# EAGLE design STl-Link-V303 (EAGLE 7.6.0)
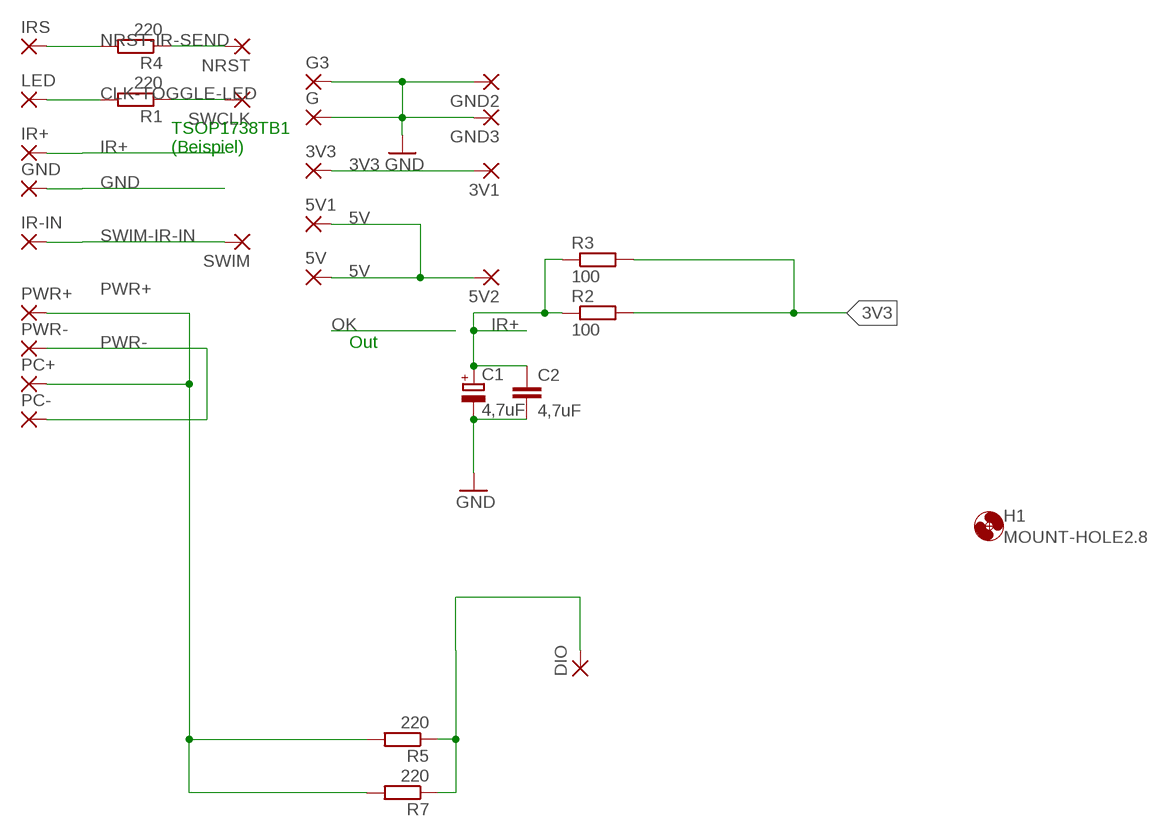
[diagram p0: schematic, sheet 1]

## Parts
3V1  SMD2  [SMD1,27-2,54]
3V3  SMD2  [SMD1,27-2,54]
5V  SMD2  [SMD1,27-2,54]
5V1  SMD2  [SMD1,27-2,54]
5V2  SMD2  [SMD1,27-2,54]
C1  4,7uF  CPOL-EUE1.8-4  [E1,8-4]
C2  4,7uF  C-EUC1206K  [C1206K]
DIO  SMD2  [SMD1,27-2,54]
G  SMD2  [SMD1,27-2,54]
G3  SMD2  [SMD1,27-2,54]
GND  SMD2  [SMD1,27-2,54]
GND2  SMD2  [SMD1,27-2,54]
GND3  SMD2  [SMD1,27-2,54]
H1  MOUNT-HOLE2.8  [2,8]
IR+  SMD2  [SMD1,27-2,54]
IR-IN  SMD2  [SMD1,27-2,54]
IRS  SMD2  [SMD1,27-2,54]
LED  SMD2  [SMD1,27-2,54]
NRST  SMD2  [SMD1,27-2,54]
PC+  SMD2  [SMD1,27-2,54]
PC-  SMD2  [SMD1,27-2,54]
PWR+  SMD2  [SMD1,27-2,54]
PWR-  SMD2  [SMD1,27-2,54]
R1  220  R-EU_R0805W  [R0805W]
R2  100  R-EU_0204/7  [0204/7]
R3  100  R-EU_R0805W  [R0805W]
R4  220  R-EU_R0805W  [R0805W]
R5  220  R-EU_0204/7  [0204/7]
R7  220  R-EU_R0805W  [R0805W]
SWCLK  SMD2  [SMD1,27-2,54]
SWIM  SMD2  [SMD1,27-2,54]

## Nets
3V3: 3V1.1(P) 3V3.1(P) R2.2 R3.2
5V [Power]: 5V1.1(P) 5V2.1(P) 5V.1(P)
CLK-TOGGLE-LED: R1.1 SWCLK.1(P)
DIO-EINSCH: DIO.1(P) R5.1 R7.1
GND [Power]: C1.- C2.2 G3.1(P) G.1(P) GND2.1(P) GND3.1(P) GND.1(P)
IR+: C1.+ C2.1 IR+.1(P) R2.1 R3.1
N$1: NRST.1(P) R4.1
N$2: LED.1(P) R1.2
NRST-IR-SEND: IRS.1(P) R4.2
PWR+: PC+.1(P) PWR+.1(P) R5.2 R7.2
PWR-: PC-.1(P) PWR-.1(P)
SWIM-IR-IN: IR-IN.1(P) SWIM.1(P)

## Notes on the sheet
- TSOP1738TB1
  (Beispiel)
- Out

## Library data of the parts
3V1 3V3 5V 5V1 5V2 DIO G G3 GND GND2 GND3 IR+ IR-IN IRS LED NRST PC+ PC- PWR+ PWR- SWCLK SWIM = wirepad:SMD2: SMD PAD
C1 = rcl:CPOL-EU: POLARIZED CAPACITOR, European symbol
C2 = rcl:C-EU: CAPACITOR, European symbol
H1 = holes:MOUNT-HOLE: MOUNTING HOLE with drill center marker
R1-R5 R7 = rcl:R-EU_: RESISTOR, European symbol

## Net classes
0 default: width 0.406 mm
1 Power: width 0.61 mm

## Board
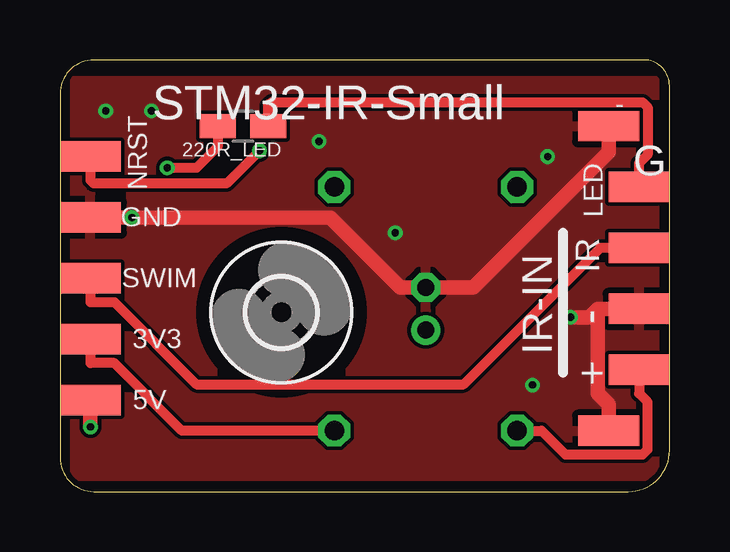
[diagram p1: board, top side]
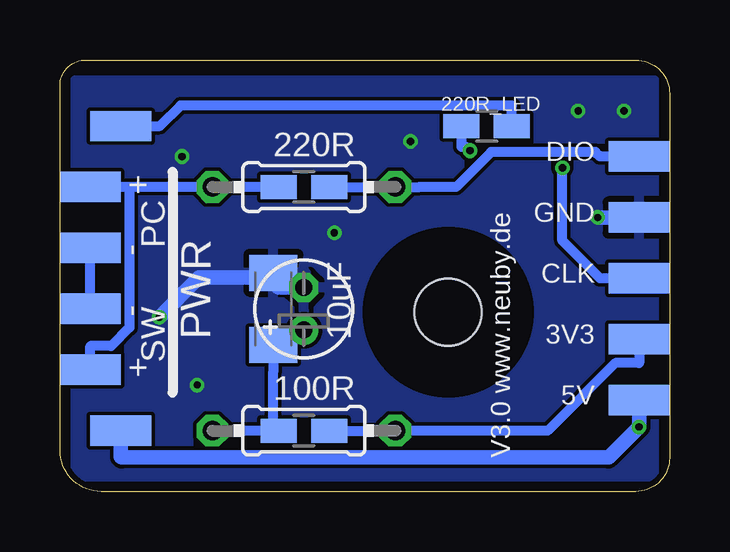
[diagram p2: board, bottom side, seen from below]

Size 25.4 x 18 mm. Coordinates in mm from the lower left corner, seen from the top.
Outline: 0,16.59 0,1.41 arc90 1.41,0 23.68,0 arc90 25.4,1.72 25.4,16.92 arc90 24.32,18 1.41,18 arc90 0,16.59
Copper layers (1*16): Top 0.035mm / dielectric 1.5mm / Bottom 0.035mm
Design rules "Fusion_eagle_rule_v1.1": minimum track width 6mil, minimum drill 12mil, track to track 6mil, track to pad 6mil, pad to pad 6mil, via to via 6mil, smd to smd 0mil, copper to edge 10mil, drill to drill 10mil, minimum pad ring 10mil, minimum via ring 6mil, stop-mask expansion 2mil, vias tented up to drill 100mil, thermal gap 10mil

### Footprints (pad centres in the part's own frame; a part is rotated, then mirrored left to right if it is on the bottom)
SMD1,27-2,54 = smd 1.27 x 2.54: 1 0,0
E1,8-4 = drill 0.711 pad 1.168: + -0.889,0 | drill 0.711 pad 1.168 octagon: - 0.889,0
C1206K = smd 1.5 x 2: 1 -1.5,0; 2 1.5,0
2,8 = hole 2.8: 0,0
R0805W = smd 1.5 x 1: 1 -1.052,0; 2 1.052,0
0204/7 = drill 0.813 octagon: 1 -3.81,0; 2 3.81,0

### Placement (x,y rotation side)
3V1  1.27,6.35 90 top
3V3  1.27,6.35 90 bottom
5V  22.86,2.54 270 bottom
5V1  1.27,3.81 90 bottom
5V2  1.27,3.81 90 top
C1  15.24,7.62 90 bottom
C2  16.51,7.62 90 bottom
DIO  1.27,13.97 90 bottom
G  22.86,15.24 90 top
G3  22.86,2.54 90 top
GND  24.13,7.62 90 top
GND2  1.27,11.43 90 top
GND3  1.27,11.43 90 bottom
H1  9.22,7.47 0 top
IR+  24.13,5.08 90 top
IR-IN  24.13,10.16 90 top
IRS  22.86,15.24 270 bottom
LED  24.13,12.7 270 top
NRST  1.27,13.97 90 top
PC+  24.13,12.7 90 bottom
PC-  24.13,10.16 90 bottom
PWR+  24.13,5.08 90 bottom
PWR-  24.13,7.62 90 bottom
R1  7.62,15.24 0 top
R2  15.24,2.54 0 bottom
R3  15.24,2.54 0 bottom
R4  7.62,15.24 0 bottom
R5  15.24,12.7 180 bottom
R7  15.24,12.7 180 bottom
SWCLK  1.27,8.89 90 bottom
SWIM  1.27,8.89 90 top

### Tracks (layer width: path | path; a pad name or v marks a point on that pad's centre or on a via)
3V3
  Top 0.406: 3V1.1 1.27,5.36 2.26,5.36 5.08,2.54 R2.2
  Bottom 0.406: 3V1.1 1.27,5.36 2.26,5.36 5.08,2.54 R2.2 R3.2
5V  (via drill 0.3 pad 0.61)
  Top 0.61: 5V2.1 v1.27,2.69
  Bottom 0.61: 5V.1 22.86,1.45 22.83,1.42 2.54,1.42 v1.27,2.69 5V2.1
CLK-TOGGLE-LED  (via drill 0.3 pad 0.61)
  Top 0.406: R1.1 6.57,14.38 5.69,13.51 v4.47,13.51
  Bottom 0.406: SWCLK.1 2.9,8.89 4.47,10.46 v4.47,13.51
DIO-EINSCH
  Bottom 0.406: R7.1 R5.1 10.41,12.7 8.9,12.7 7.43,14.17 3.09,14.17 2.9,13.97 DIO.1
GND  (via drill 0.3 pad 0.61)
  Top 0.61: v21.27,7.26 22.05,7.26 22.4,7.62 | 22.4,7.62 22.4,4.09 22.86,3.63 G3.1 | GND.1 22.4,7.62 | G.1 22.86,14.15 17.22,8.51 16.31,8.51 C1.- 14.84,8.51 14.17,8.51 11.25,11.43 v3,11.43 GND3.1
  Bottom 0.61: 16.51,8.92 19.61,8.92 v21.27,7.26 | 16.51,8.92 16.31,8.71 16.31,8.51 C1.- | 16.51,8.92 C2.2 | GND3.1 v3,11.43
  other vias: 1.91,15.88 3.81,15.88 10.79,14.61 20.32,13.97 13.97,10.79 19.68,4.45
  pour Bottom: 0.64,17.14 24.77,17.14 24.77,0.64 0.64,0.64
  pour Top: 0.64,17.14 24.77,17.14 24.77,0.64 0.64,0.64
IR+
  Top 0.406: IR+.1 24.13,4.09 24.49,3.73 24.49,1.76 24.28,1.55 21.06,1.55 20.07,2.54 R2.1
  Bottom 0.406: 16.51,2.54 R2.1 | R3.1 16.51,2.54 | 16.51,2.54 16.51,5.01 C2.1 15.85,6.12 C1.+
N$1  (via drill 0.3 pad 0.61)
  Top 0.406: NRST.1 1.27,12.98 1.41,12.84 6.94,12.84 v8.31,14.22
  Bottom 0.406: R4.1 8.67,14.38 8.48,14.38 v8.31,14.22
N$2
  Top 0.406: LED.1 24.13,13.69 24.49,14.05 24.49,16.02 24.28,16.23 8.81,16.23 8.67,16.1 R1.2
NRST-IR-SEND
  Bottom 0.406: IRS.1 21.23,15.24 20.38,16.1 6.57,16.1 R4.2
PWR+
  Bottom 0.406: 22.5,12.7 PC+.1 | 22.5,12.7 R5.2 R7.2 | 22.5,12.7 22.5,6.84 23.27,6.07 24.13,6.07 PWR+.1
PWR-
  Bottom 0.406: PWR-.1 PC-.1
SWIM-IR-IN
  Top 0.406: IR-IN.1 22.5,10.16 16.82,4.47 5.69,4.47 2.26,7.9 1.27,7.9 SWIM.1

### Text on the board
tNames: - | STM32-IR-Small | STM32-IR-Small | 220R_LED | NRST | GND | LED | SWIM | IR | 3V3 | - | IR-IN | 5V | +
bNames: 220R_LED | DIO | 220R | GND | + | CLK | 10uF | PC | - | 3V3 | - | PWR | SW | + | 5V | 100R | V3.0 www.neuby.de
tValues: www.neuby.de
bValues: IRSen | - | 5V